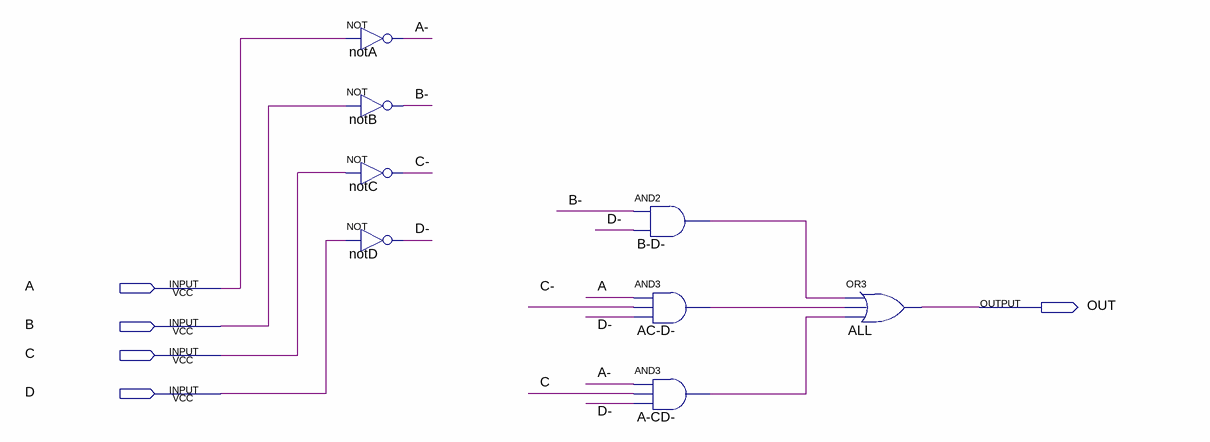
[diagram p0: schematic sheet]
// Quartus schematic e.bdf as structural Verilog: 8 symbols, 5 pins
module e (
  input  A,
  input  B,
  input  C,
  input  D,
  output OUT
);

  wire \A- , A_CD__out, AC_D__out, \B- , B_D__out, \C- , \D- ;

  not notA (\A- , A);
  not notB (\B- , B);
  not notC (\C- , C);
  not notD (\D- , D);
  and \B-D-  (B_D__out, \B- , \D- );
  and \AC-D-  (AC_D__out, A, \C- , \D- );
  and \A-CD-  (A_CD__out, \A- , C, \D- );
  or ALL (OUT, B_D__out, AC_D__out, A_CD__out);
endmodule
